# EAGLE schematic ATTiny85 Programmer Arduino Shield (EAGLE 7.2.0)
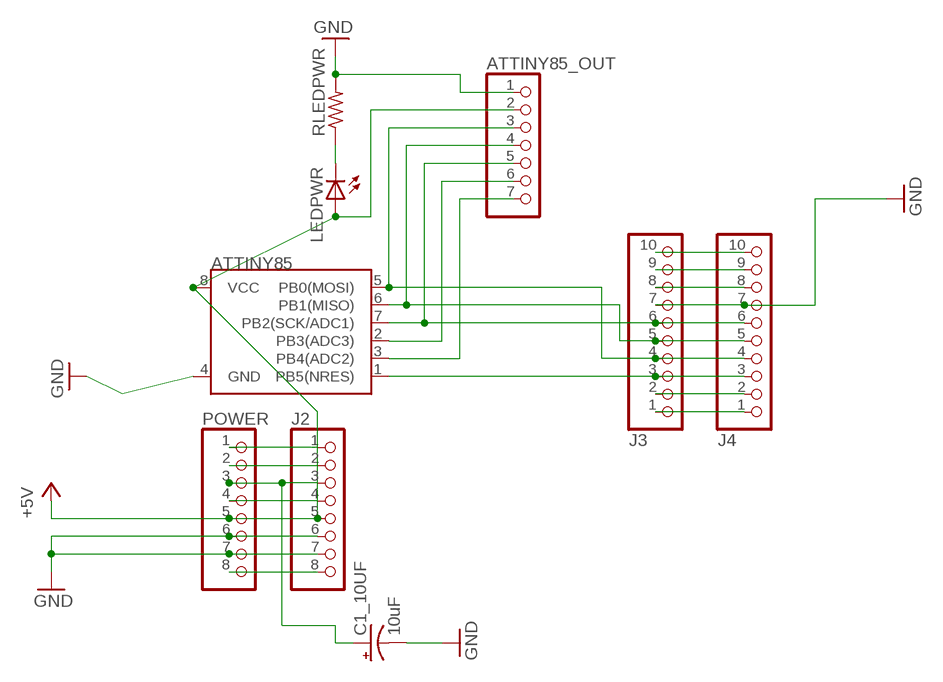
[diagram p0: schematic, sheet 1]

## Parts
ATTINY85  TINY85-20-DIP  ATTINY45TINY85-20-DIP  [DIP08]
ATTINY85_OUT  PINHD-1X7  [1X07]
C1_10UF  10uF  10UF-16V-10%(TANT)  [EIA3216]
J2  PINHD-1X8TH  [1X08-TH]
J3  PINHD-1X10TH  [1X10-TH]
J4  PINHD-1X10TH  [1X10-TH]
LEDPWR  LEDCHIPLED_0805  [CHIPLED_0805]
POWER  PINHD-1X8TH  [1X08-TH]
RLEDPWR  R-US_R0805  [R0805]

## Nets
+5V: ATTINY85.8(VCC) ATTINY85_OUT.2 J2.5 LEDPWR.A POWER.5
+9V: J2.8 POWER.8
GND: ATTINY85.4(GND) ATTINY85_OUT.1 C1_10UF.C(-) J2.7 J3.7 J4.7 POWER.7 RLEDPWR.2
N$1: ATTINY85.7(PB2(SCK/ADC1)) ATTINY85_OUT.5 J3.6 J4.6
N$2: J3.1 J4.1
N$3: ATTINY85.5(PB0(MOSI)) ATTINY85_OUT.3 J3.4 J4.4
N$4: ATTINY85.6(PB1(MISO)) ATTINY85_OUT.4 J3.5 J4.5
N$5: LEDPWR.C RLEDPWR.1
N$6: J3.2 J4.2
N$7: ATTINY85.1(PB5(NRES)) J3.3 J4.3
N$16: ATTINY85.2(PB3(ADC3)) ATTINY85_OUT.6
N$17: ATTINY85.3(PB4(ADC2)) ATTINY85_OUT.7
N$25: J2.6 POWER.6
N$31: J2.2 POWER.2
N$32: J2.1 POWER.1
N$141: J3.9 J4.9
N$142: J3.10 J4.10
N$222: J3.8 J4.8
N$223: J2.4 POWER.4
RESET: C1_10UF.A(+) J2.3 POWER.3

## Library data of the parts
ATTINY85 = SparkFun-DigitalIC:ATTINY45: Atmel 8-pin 2/4/8kB flash uC; PROD_ID: IC-09445
ATTINY85_OUT = pinhead:PINHD-1X7: PIN HEADER
C1_10UF = SparkFun-Capacitors:10UF-16V-10%(TANT): CAP-00811 1206/EIA-3216 Tantalum capacitor; PROD_ID: CAP-00811
J2 POWER = SmartPrj:PINHD-1X8: PIN HEADER
J3 J4 = SmartPrj:PINHD-1X10: PIN HEADER
LEDPWR = adafruit:LED: LED OSRAM: - CHIPLED LG R971, LG N971, LY N971, LG Q971, LY Q971, LO R971, LY R971 LH N974, LH R974 LS Q976, LO Q976, LY Q976 LO Q996 - Hyper CHIPLED LW Q18S LB Q993, LB Q99A, LB R99A - SideLED LS A670, LO A670, LY A670, LG A670, LP A670 LB A673, LV A673, LT A673, LW A673 LH A674 LY A675 LS A676, LA A676, LO A676, LY A676, LW A676 LS A679, LY A679, LG A679 - Hyper Micro SIDELED® LS Y876, LA Y876, LO Y876, LY Y876 LT Y87S - SmartLED LW L88C, LW L88S LB L89C, LB L89S, LG L890 LS L89K, LO L89K, LY L89K LS L896, LA L896, LO L896, LY L896 - TOPLED LS T670, LO T670, LY T670, LG T670, LP T670 LSG T670, LSP T670, LSY T670, LOP T670, LYG T670 LG T671, LOG T671, LSG T671 LB T673, LV T673, LT T673, LW T673 LH T674 LS T676, LA T676, LO T676, LY T676, LB T676, LH T676, LSB T676, LW T676 LB T67C, LV T67C, LT T67C, LS T67K, LO T67K, LY T67K, LW E67C LS E67B, LA E67B, LO E67B, LY E67B, LB E67C, LV E67C, LT E67C LW T67C LS T679, LY T679, LG T679 LS T770, LO T770, LY T770, LG T770, LP T770 LB T773, LV T773, LT T773, LW T773 LH T774 LS E675, LA E675, LY E675, LS T675 LS T776, LA T776, LO T776, LY T776, LB T776 LHGB T686 LT T68C, LB T68C - Hyper Mini TOPLED® LB M676 - Mini TOPLED Santana® LG M470 LS M47K, LO M47K, LY M47K Source: http://www.osram.convergy.de/
RLEDPWR = adafruit:R-US_: RESISTOR, American symbol